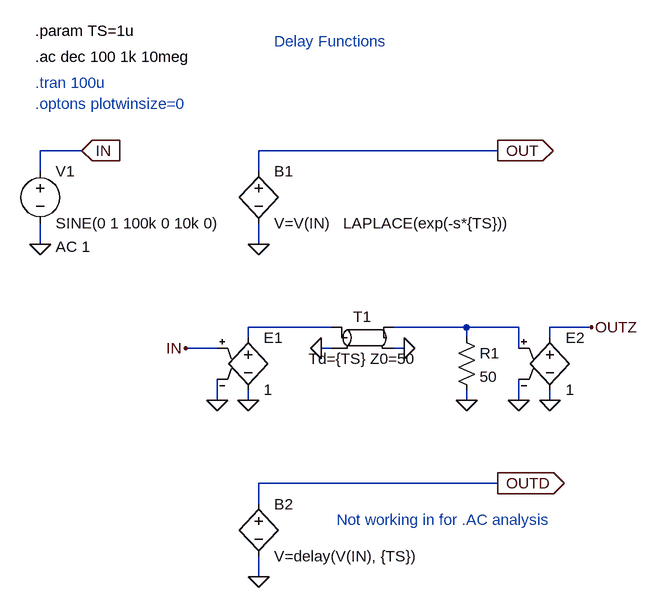
[diagram p0: schematic Delay_sT_Tline_Delay.asc]
Delay_sT_Tline_Delay.asc, the LTspice schematic file:
Version 4
SHEET 1 880 900
WIRE -16 224 -80 224
WIRE 624 224 256 224
WIRE -80 256 -80 224
WIRE 256 256 256 224
WIRE -80 368 -80 336
WIRE 256 368 256 336
WIRE 368 496 240 496
WIRE 576 496 464 496
WIRE 656 496 576 496
WIRE 768 496 704 496
WIRE 240 512 240 496
WIRE 576 512 576 496
WIRE 704 512 704 496
WIRE 192 528 144 528
WIRE 368 528 352 528
WIRE 480 528 464 528
WIRE 656 528 656 496
WIRE 192 608 192 576
WIRE 240 608 240 592
WIRE 576 608 576 592
WIRE 656 608 656 576
WIRE 704 608 704 592
WIRE 624 736 256 736
WIRE 256 768 256 736
WIRE 256 880 256 848
FLAG 256 368 0
FLAG -16 224 IN
IOPIN -16 224 In
FLAG 624 224 OUT
IOPIN 624 224 Out
FLAG -80 368 0
FLAG 576 608 0
FLAG 352 528 0
FLAG 480 528 0
FLAG 240 608 0
FLAG 192 608 0
FLAG 704 608 0
FLAG 656 608 0
FLAG 768 496 OUTZ
FLAG 144 528 IN
FLAG 256 880 0
FLAG 624 736 OUTD
IOPIN 624 736 Out
SYMBOL bv 256 240 R0
SYMATTR InstName B1
SYMATTR Value V=V(IN)   LAPLACE(exp(-s*{TS}))
SYMBOL voltage -80 240 R0
WINDOW 123 24 132 Left 0
WINDOW 39 0 0 Left 0
SYMATTR InstName V1
SYMATTR Value SINE(0 1 100k 0 10k 0)
SYMATTR Value2 AC 1
SYMBOL tline 416 512 R0
SYMATTR InstName T1
SYMATTR Value Td={TS} Z0=50
SYMBOL e 240 496 R0
SYMATTR InstName E1
SYMATTR Value 1
SYMBOL e 704 496 R0
SYMATTR InstName E2
SYMATTR Value 1
SYMBOL res 560 496 R0
SYMATTR InstName R1
SYMATTR Value 50
SYMBOL bv 256 752 R0
SYMATTR InstName B2
SYMATTR Value V=delay(V(IN), {TS})
TEXT -88 40 Left 0 !.param TS=1u
TEXT -88 80 Left 0 !.ac dec 100 1k 10meg
TEXT -88 120 Left 0 ;.tran 100u
TEXT -88 152 Left 0 ;.optons plotwinsize=0
TEXT 280 56 Left 0 ;Delay Functions
TEXT 376 792 Left 0 ;Not working in for .AC analysis

The netlist it stands for:
* Delay_sT_Tline_Delay.asc
B1 OUT 0 V=V(IN)   LAPLACE(exp(-s*{TS}))
V1 IN 0 SINE(0 1 100k 0 10k 0) AC 1
T1 N001 0 N002 0 Td={TS} Z0=50
E1 N001 0 IN 0 1
E2 OUTZ 0 N002 0 1
R1 N002 0 50
B2 OUTD 0 V=delay(V(IN), {TS})
.param TS=1u
.ac dec 100 1k 10meg
* .tran 100u
* .optons plotwinsize=0
* Delay Functions
* Not working in for .AC analysis
.backanno
.end